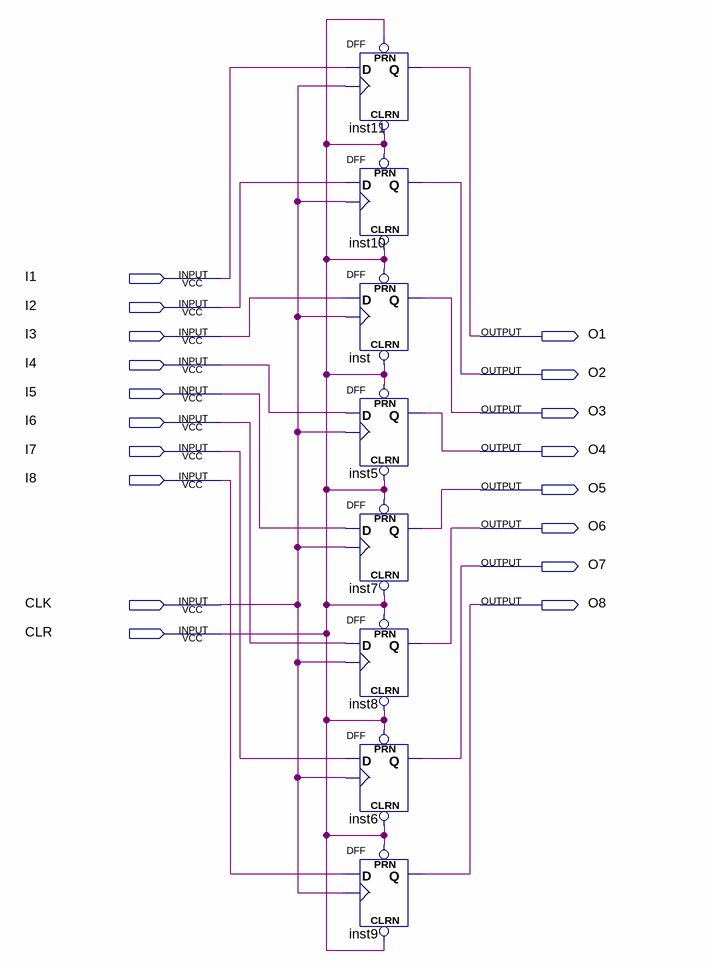
[diagram p0: schematic sheet]
// Quartus schematic 8r.bdf as structural Verilog: 8 symbols, 18 pins
module \8r  (
  input  I1,
  input  I2,
  input  I3,
  input  I4,
  input  I5,
  input  I6,
  input  I7,
  input  I8,
  input  CLK,
  input  CLR,
  output O1,
  output O2,
  output O3,
  output O4,
  output O5,
  output O6,
  output O7,
  output O8
);

  DFF inst11 (.CLRN(CLR), .CLK(CLK), .D(I1), .PRN(CLR), .Q(O1));
  DFF inst10 (.CLRN(CLR), .CLK(CLK), .D(I2), .PRN(CLR), .Q(O2));
  DFF inst (.CLRN(CLR), .CLK(CLK), .D(I3), .PRN(CLR), .Q(O3));
  DFF inst5 (.CLRN(CLR), .CLK(CLK), .D(I4), .PRN(CLR), .Q(O4));
  DFF inst7 (.CLRN(CLR), .CLK(CLK), .D(I5), .PRN(CLR), .Q(O5));
  DFF inst8 (.CLRN(CLR), .CLK(CLK), .D(I6), .PRN(CLR), .Q(O6));
  DFF inst6 (.CLRN(CLR), .CLK(CLK), .D(I7), .PRN(CLR), .Q(O7));
  DFF inst9 (.CLRN(CLR), .CLK(CLK), .D(I8), .PRN(CLR), .Q(O8));
endmodule
